# EAGLE design BSS123_divider_switch_simple (EAGLE 9.3.0)
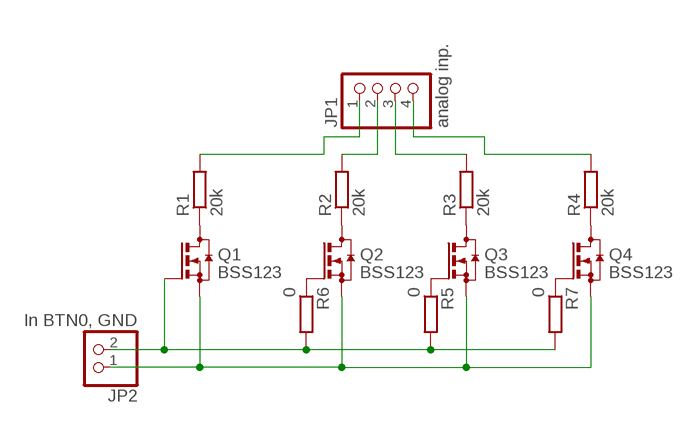
[diagram p0: schematic, sheet 1]

## Parts
JP1  analog inp.  PINHD-1X4  [1X04]
JP2  In BTN0, GND  PINHD-1X2  [1X02]
Q1  BSS123  [SOT23]
Q2  BSS123  [SOT23]
Q3  BSS123  [SOT23]
Q4  BSS123  [SOT23]
R1  20k  R-EU_R1206  [R1206]
R2  20k  R-EU_R1206  [R1206]
R3  20k  R-EU_R1206  [R1206]
R4  20k  R-EU_R1206  [R1206]
R5  0  R-EU_R1206  [R1206]
R6  0  R-EU_R1206  [R1206]
R7  0  R-EU_R1206  [R1206]

## Nets
N$1: Q1.3(D) R1.1
N$2: Q2.3(D) R2.1
N$3: Q3.3(D) R3.1
N$4: Q4.3(D) R4.1
N$6: Q4.1(G) R7.1
N$7: JP2.1 Q1.2(S) Q2.2(S) Q3.2(S) Q4.2(S)
N$8: JP1.1 R1.2
N$9: JP1.2 R2.2
N$10: JP1.3 R3.2
N$11: JP1.4 R4.2
N$12: Q2.1(G) R6.1
N$13: Q3.1(G) R5.1
N$14: JP2.2 Q1.1(G) R5.2 R6.2 R7.2

## Library data of the parts
JP1 = pinhead:PINHD-1X4: PIN HEADER
JP2 = pinhead:PINHD-1X2: PIN HEADER
Q1-Q4 = transistor-small-signal:BSS123: N-CHANNEL MOS FET
R1-R7 = rcl:R-EU_: RESISTOR, European symbol; SPICEPREFIX: R

## Board
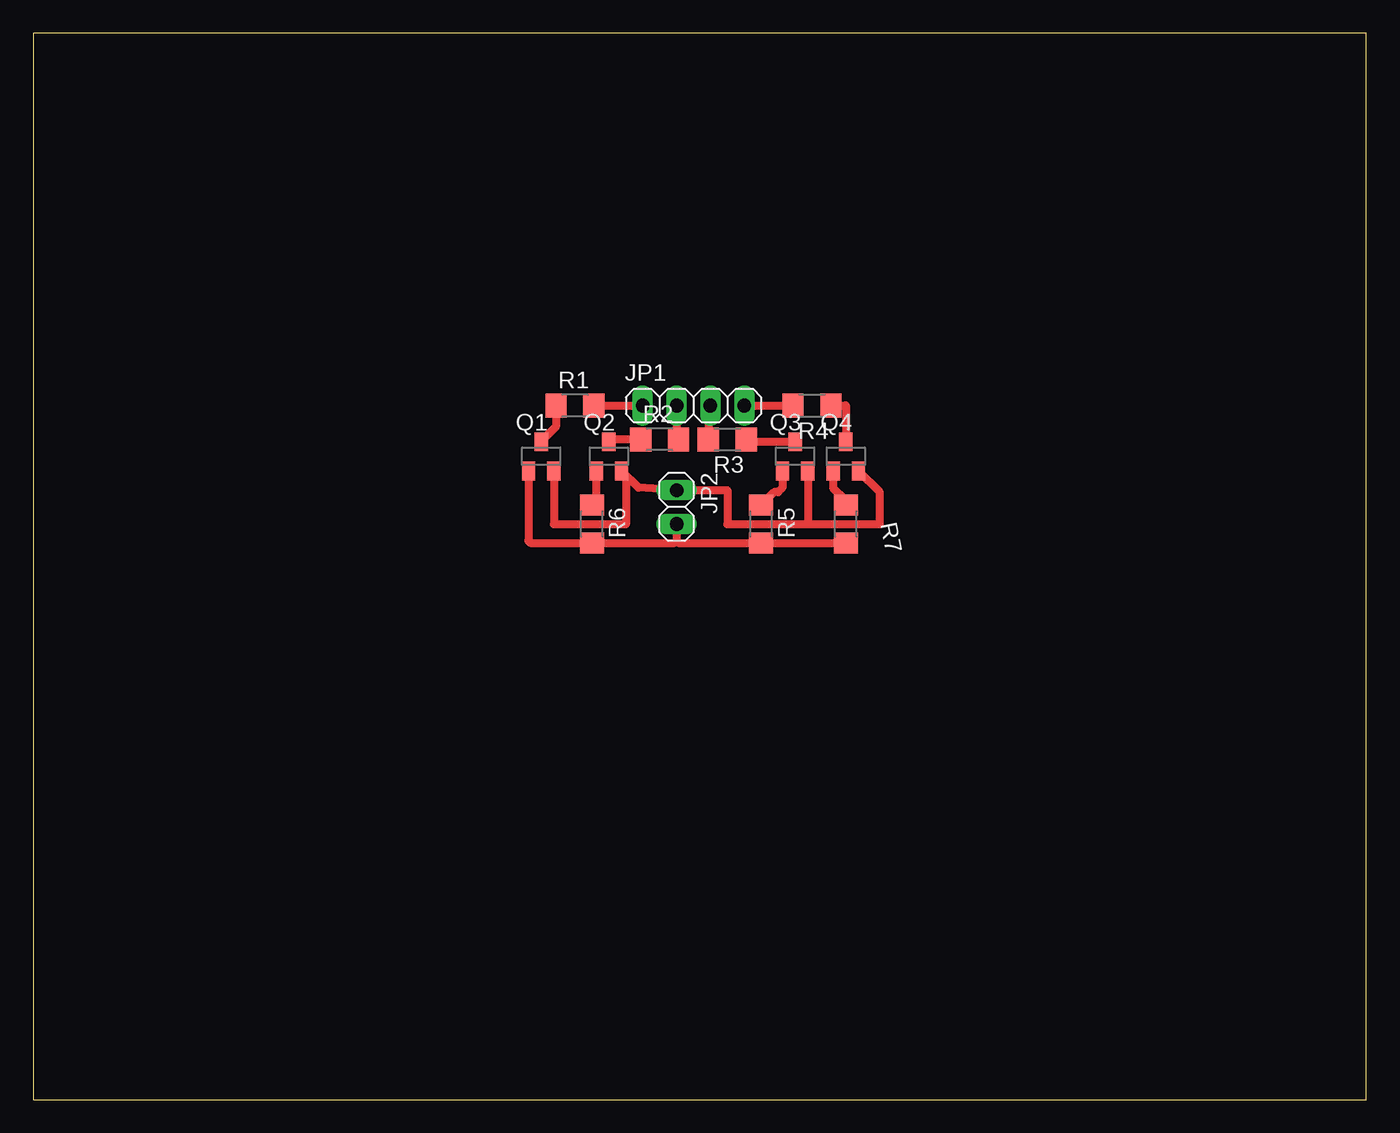
[diagram p1: board, top side]

Size 100 x 80 mm. Coordinates in mm from the lower left corner, seen from the top.
Outline: 0,0 100,0 100,80 0,80 0,0
Copper layers (1*16): Top 0.035mm / dielectric 1.5mm / Bottom 0.035mm
Design rules "default": minimum track width 6mil, minimum drill 0.35mm, track to track 6mil, track to pad 6mil, pad to pad 6mil, via to via 6mil, smd to smd 6mil, copper to edge 40mil, drill to drill 6mil, minimum pad ring 10mil, minimum via ring 8mil, stop-mask expansion 4mil, vias tented up to drill 0mil, thermal gap 10mil

### Footprints (pad centres in the part's own frame; a part is rotated, then mirrored left to right if it is on the bottom)
1X04 = drill 1.016 long: 1 -3.81,0; 2 -1.27,0; 3 1.27,0; 4 3.81,0
1X02 = drill 1.016 long: 1 -1.27,0; 2 1.27,0
SOT23 = smd 1 x 1.4: 1 -0.95,-1.1; 2 0.95,-1.1; 3 0,1.1
R1206 = smd 1.6 x 1.803: 1 -1.422,0; 2 1.422,0

### Placement (x,y rotation side)
JP1  49.53,52.07 0 top
JP2  48.26,44.45 270 top
Q1  38.1,48.26 0 top
Q2  43.18,48.26 0 top
Q3  57.15,48.26 0 top
Q4  60.96,48.26 0 top
R1  40.64,52.07 0 top
R2  46.99,49.53 0 top
R3  52.07,49.53 180 top
R4  58.42,52.07 180 top
R5  54.61,43.18 270 top
R6  41.91,43.18 270 top
R7  60.96,43.18 270 top

### Tracks (layer width: path | path; a pad name or v marks a point on that pad's centre or on a via)
N$1
  Top 0.61: R1.1 39.22,50.48 Q1.3
N$2
  Top 0.61: R2.1 43.35,49.53 Q2.3
N$3
  Top 0.61: R3.1 53.66,49.36 Q3.3
N$4
  Top 0.61: R4.1 60.96,52.07 Q4.3
N$6
  Top 0.61: Q4.1 60.01,45.89 60.96,44.94 R7.1
N$7
  Top 0.61: Q1.2 39.05,43.18 44.45,43.18 44.45,46.84 Q2.2 45.39,45.9 JP2.1 52.07,45.72 52.07,43.18 58.1,43.18 | Q4.2 63.5,45.57 63.5,43.18 58.1,43.18 | Q3.2 58.1,43.18
N$8
  Top 0.61: R1.2 JP1.1
N$9
  Top 0.61: JP1.2 48.26,49.68 R2.2
N$10
  Top 0.61: JP1.3 50.65,51.92 R3.2
N$11
  Top 0.61: JP1.4 R4.2
N$12
  Top 0.61: Q2.1 42.23,44.51 R6.1
N$13
  Top 0.61: R5.1 55.58,45.57 55.88,45.57 56.2,45.89 Q3.1
N$14
  Top 0.61: Q1.1 37.15,41.91 37.3,41.76 R6.2 48.11,41.76 48.26,41.91 | JP2.2 48.26,41.91 | 48.26,41.91 48.41,41.76 R5.2 R7.2